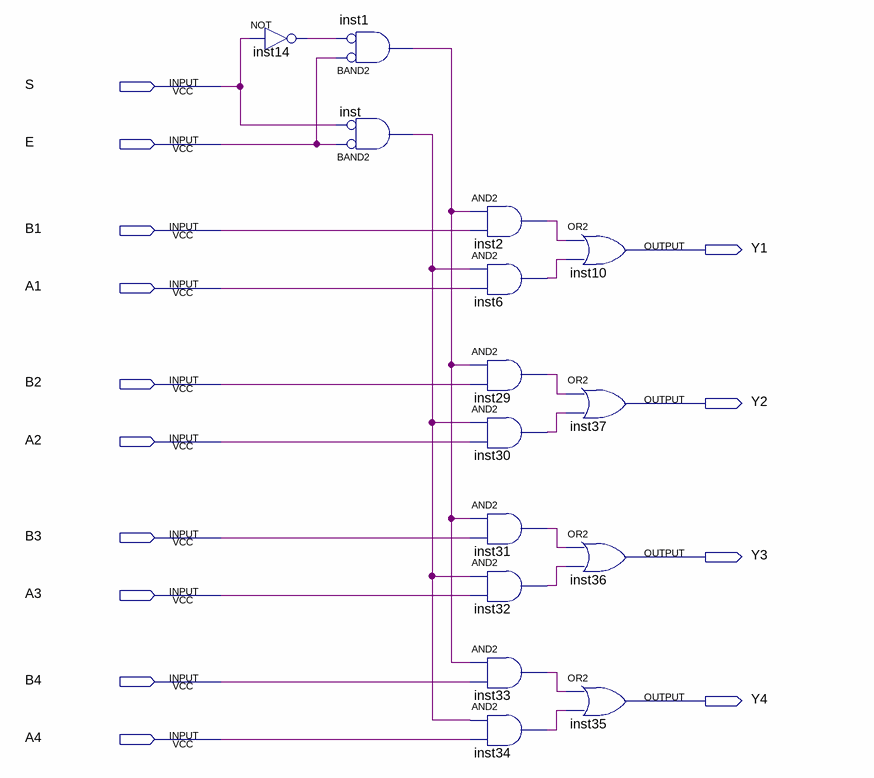
[diagram p0: schematic sheet]
// Quartus schematic ci_74LS157_lucas.bdf as structural Verilog: 15 symbols, 14 pins
module ci_74LS157_lucas (
  input  S,
  input  E,
  input  B1,
  input  A1,
  input  B2,
  input  A2,
  input  B3,
  input  A3,
  input  B4,
  input  A4,
  output Y1,
  output Y2,
  output Y3,
  output Y4
);

  wire inst1_out, inst2_out, inst6_out, inst14_out, inst29_out, inst30_out, inst31_out, inst32_out,
       inst33_out, inst34_out, inst_out;

  not inst14 (inst14_out, S);
  and inst1 (inst1_out, ~E, ~inst14_out);  // BAND2
  and inst (inst_out, ~E, ~S);  // BAND2
  and inst2 (inst2_out, inst1_out, B1);
  and inst6 (inst6_out, inst_out, A1);
  and inst29 (inst29_out, inst1_out, B2);
  and inst30 (inst30_out, inst_out, A2);
  and inst31 (inst31_out, inst1_out, B3);
  and inst32 (inst32_out, inst_out, A3);
  and inst33 (inst33_out, inst1_out, B4);
  and inst34 (inst34_out, inst_out, A4);
  or inst10 (Y1, inst2_out, inst6_out);
  or inst37 (Y2, inst29_out, inst30_out);
  or inst36 (Y3, inst31_out, inst32_out);
  or inst35 (Y4, inst33_out, inst34_out);
endmodule
